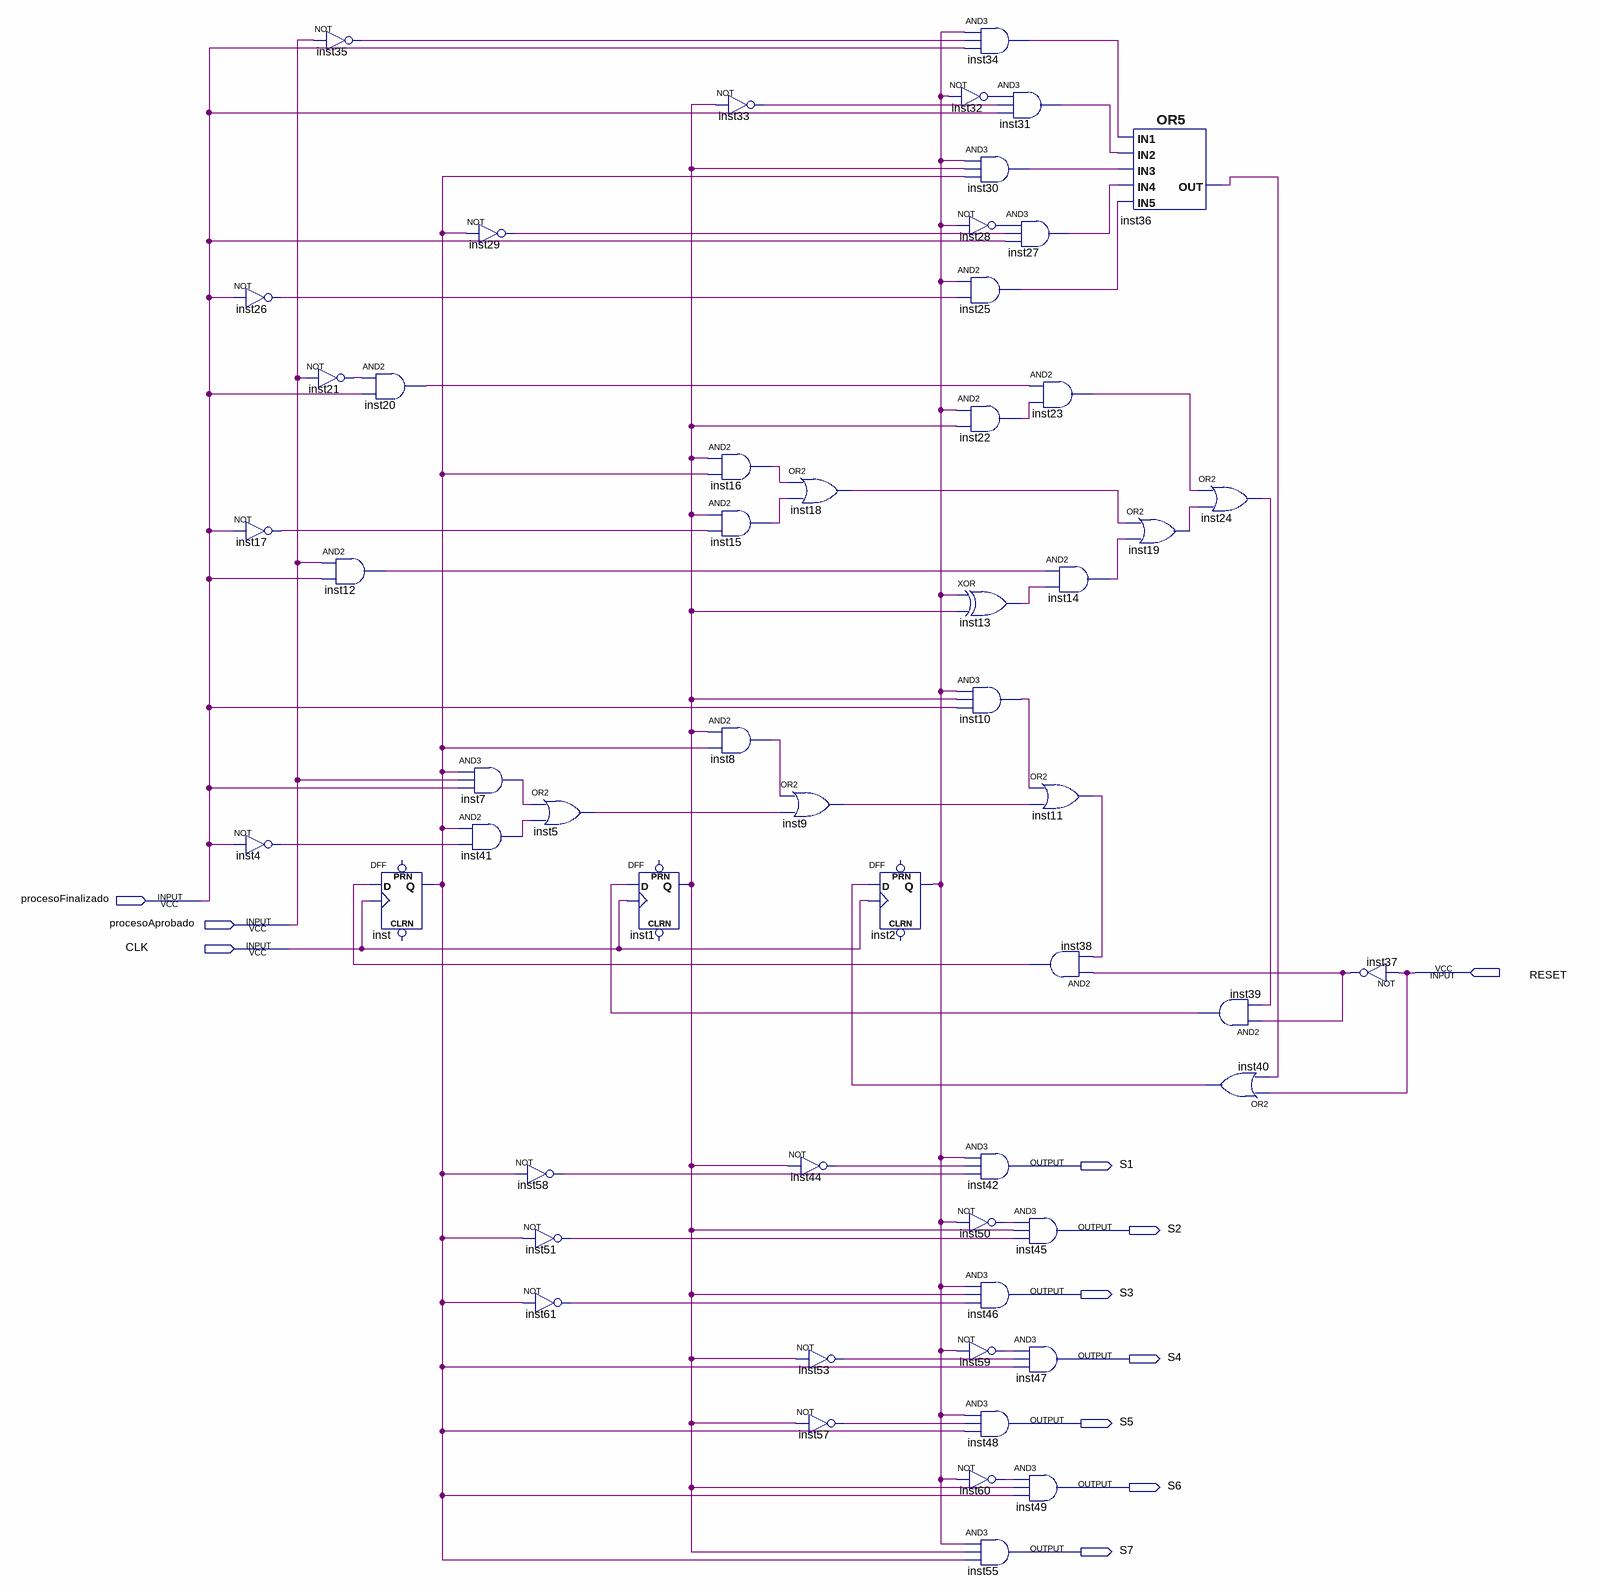
[diagram p0: schematic sheet]
// Quartus schematic maquinaEstadosPrincipal.bdf as structural Verilog: 56 symbols, 11 pins
module maquinaEstadosPrincipal (
  input  procesoFinalizado,
  input  procesoAprobado,
  input  CLK,
  input  RESET,
  output S1,
  output S2,
  output S3,
  output S4,
  output S5,
  output S6,
  output S7
);

  wire inst1_q, inst2_q, inst4_out, inst5_out, inst7_out, inst8_out, inst9_out, inst10_out, inst11_out,
       inst12_out, inst13_out, inst14_out, inst15_out, inst16_out, inst17_out, inst18_out, inst19_out,
       inst20_out, inst21_out, inst22_out, inst23_out, inst24_out, inst25_out, inst26_out, inst27_out,
       inst28_out, inst29_out, inst30_out, inst31_out, inst32_out, inst33_out, inst34_out, inst35_out,
       inst36_out, inst37_out, inst38_out, inst39_out, inst40_out, inst41_out, inst44_out, inst50_out,
       inst51_out, inst53_out, inst57_out, inst58_out, inst59_out, inst60_out, inst61_out, inst_q;

  not inst26 (inst26_out, procesoFinalizado);
  not inst17 (inst17_out, procesoFinalizado);
  not inst4 (inst4_out, procesoFinalizado);
  not inst35 (inst35_out, procesoAprobado);
  not inst21 (inst21_out, procesoAprobado);
  and inst12 (inst12_out, procesoAprobado, procesoFinalizado);
  and inst20 (inst20_out, inst21_out, procesoFinalizado);
  DFF inst (.CLK(CLK), .D(inst38_out), .Q(inst_q));  // open: CLRN, PRN
  not inst29 (inst29_out, inst_q);
  and inst7 (inst7_out, inst_q, procesoAprobado, procesoFinalizado);
  and inst41 (inst41_out, inst_q, inst4_out);
  not inst58 (inst58_out, inst_q);
  or inst5 (inst5_out, inst7_out, inst41_out);
  not inst51 (inst51_out, inst_q);
  not inst61 (inst61_out, inst_q);
  DFF inst1 (.CLK(CLK), .D(inst39_out), .Q(inst1_q));  // open: CLRN, PRN
  and inst16 (inst16_out, inst1_q, inst_q);
  and inst15 (inst15_out, inst1_q, inst17_out);
  and inst8 (inst8_out, inst1_q, inst_q);
  not inst33 (inst33_out, inst1_q);
  or inst18 (inst18_out, inst16_out, inst15_out);
  or inst9 (inst9_out, inst8_out, inst5_out);
  not inst44 (inst44_out, inst1_q);
  not inst53 (inst53_out, inst1_q);
  not inst57 (inst57_out, inst1_q);
  DFF inst2 (.CLK(CLK), .D(inst40_out), .Q(inst2_q));  // open: CLRN, PRN
  and inst34 (inst34_out, inst2_q, inst35_out, procesoFinalizado);
  not inst32 (inst32_out, inst2_q);
  and inst30 (inst30_out, inst2_q, inst1_q, inst_q);
  not inst28 (inst28_out, inst2_q);
  and inst25 (inst25_out, inst2_q, inst26_out);
  and inst22 (inst22_out, inst2_q, inst1_q);
  xor inst13 (inst13_out, inst2_q, inst1_q);
  and inst10 (inst10_out, inst2_q, inst1_q, procesoFinalizado);
  and inst42 (S1, inst2_q, inst44_out, inst58_out);
  not inst50 (inst50_out, inst2_q);
  and inst46 (S3, inst2_q, inst1_q, inst61_out);
  not inst59 (inst59_out, inst2_q);
  and inst48 (S5, inst2_q, inst57_out, inst_q);
  not inst60 (inst60_out, inst2_q);
  and inst55 (S7, inst2_q, inst1_q, inst_q);
  and inst31 (inst31_out, inst32_out, inst33_out, procesoFinalizado);
  and inst27 (inst27_out, inst28_out, inst29_out, procesoFinalizado);
  and inst23 (inst23_out, inst20_out, inst22_out);
  or inst11 (inst11_out, inst10_out, inst9_out);
  and inst38 (inst38_out, inst37_out, inst11_out);
  and inst45 (S2, inst50_out, inst1_q, inst51_out);
  and inst47 (S4, inst59_out, inst53_out, inst_q);
  and inst49 (S6, inst60_out, inst1_q, inst_q);
  and inst14 (inst14_out, inst12_out, inst13_out);
  or inst36 (inst36_out, inst34_out, inst31_out, inst30_out, inst27_out, inst25_out);
  or inst19 (inst19_out, inst18_out, inst14_out);
  or inst24 (inst24_out, inst23_out, inst19_out);
  and inst39 (inst39_out, inst37_out, inst24_out);
  or inst40 (inst40_out, RESET, inst36_out);
  not inst37 (inst37_out, RESET);
endmodule
